# EAGLE design simple_controller (EAGLE 9.3.1)

## Sheet 1 of 3
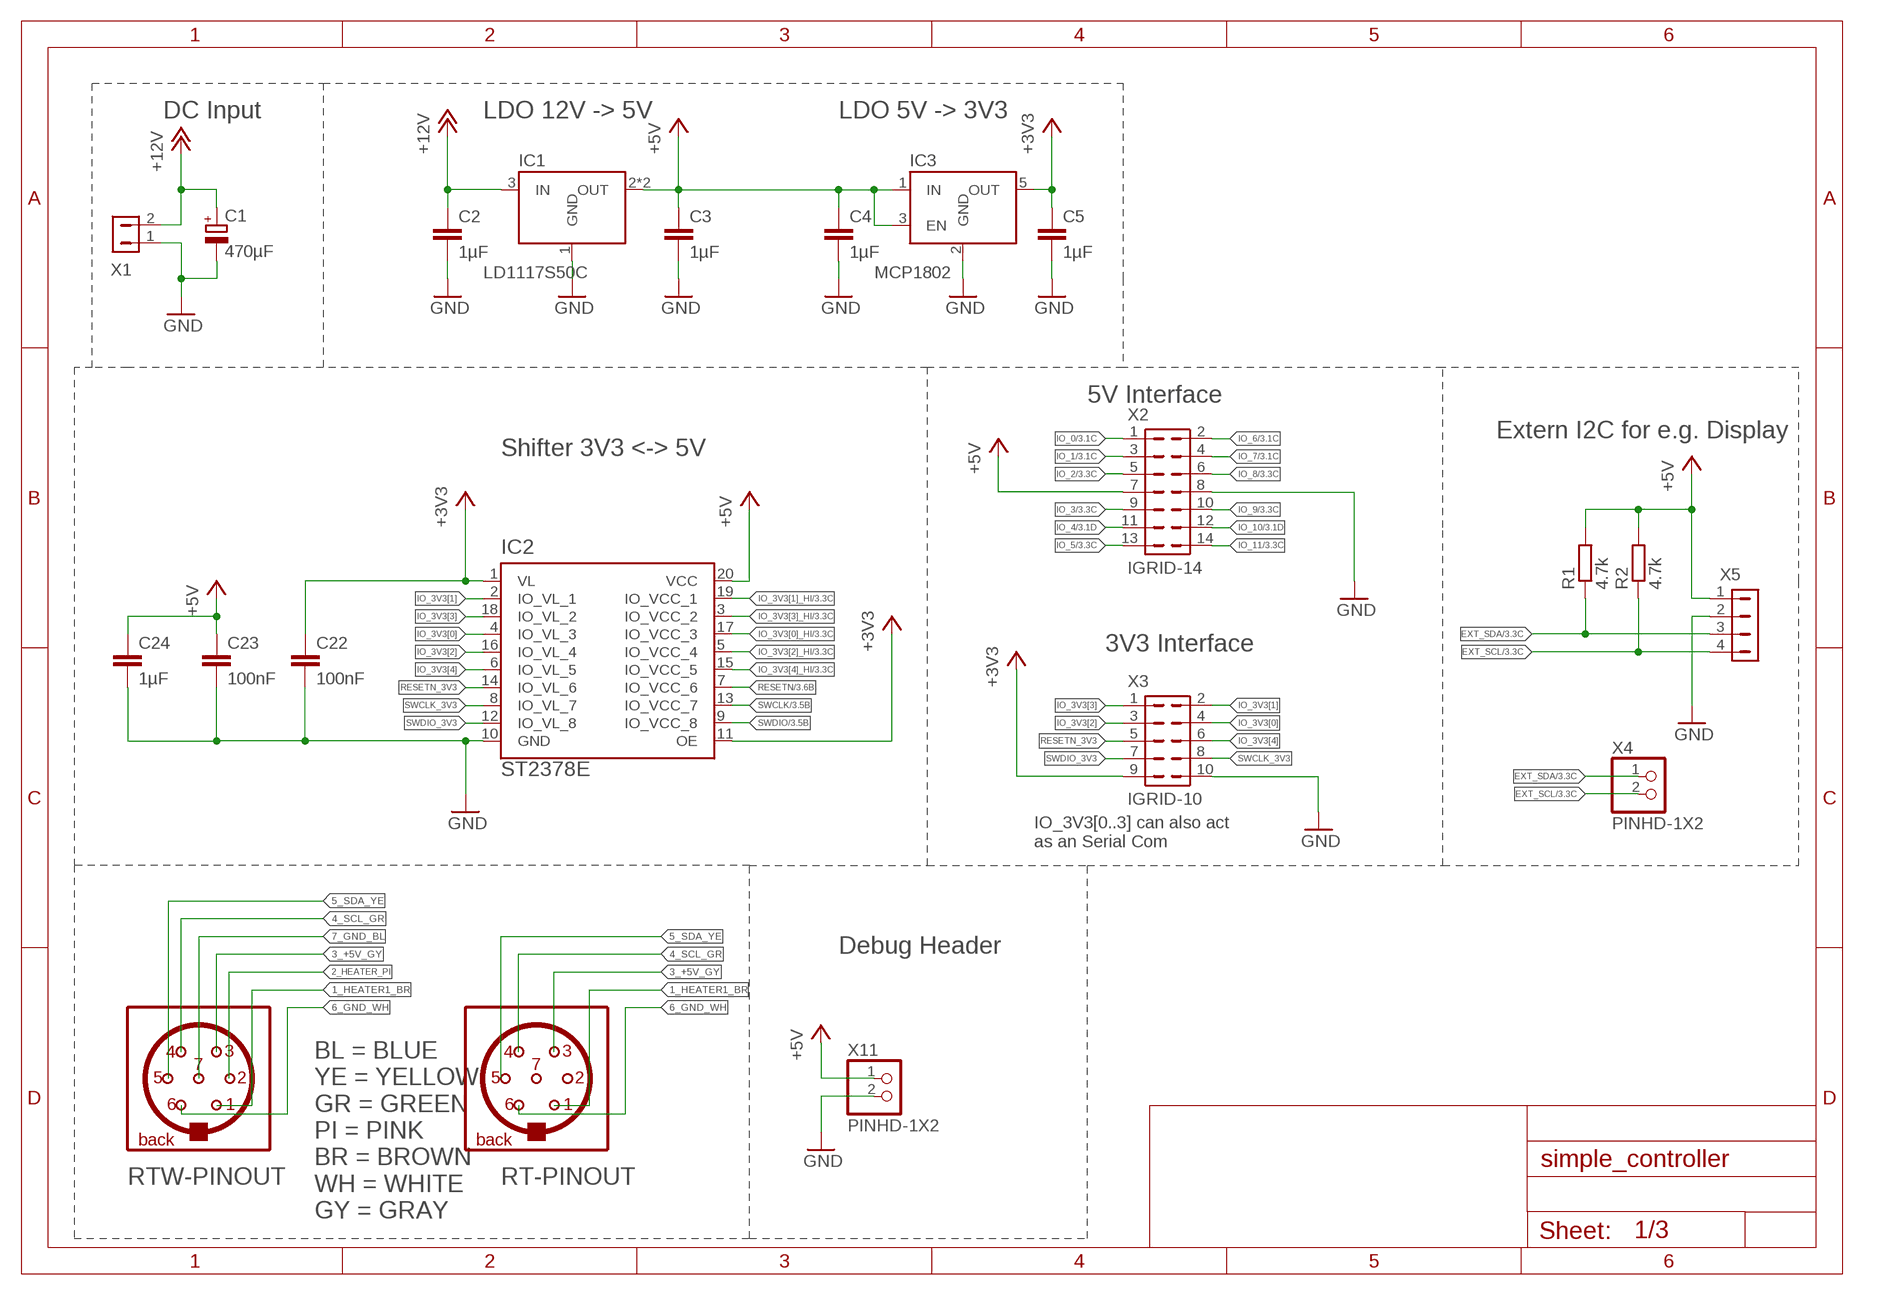
[diagram p0: schematic, sheet 1]

### Parts
C1  470µF  C-EEEFK  [C_EEEFK-10X10]
C2  1µF  C-EUC0805  [C0805]
C3  1µF  C-EUC0805  [C0805]
C4  1µF  C-EUC0805  [C0805]
C5  1µF  C-EUC0805  [C0805]
C22  100nF  C-EUC0402  [C0402]
C23  100nF  C-EUC0402  [C0402]
C24  1µF  C-EUC0402  [C0402]
CON1  BINDER-IP40  (no package)
CON2  BINDER-IP40  (no package)
IC1  LD1117S50C  [SOT223]
IC2  ST2378E  [TSSOP20]
IC3  MCP1802  [SOT23-5L]
R1  4.7k  R-EU_R0603  [R0603]
R2  4.7k  R-EU_R0603  [R0603]
X1  NANOFIT-2  [NANOFIT-2-90]
X2  IGRID-14  [I-GRID-14]
X3  IGRID-10  [I-GRID-10]
X4  PINHD-1X2  [1X02]
X5  MICRO-LATCH-4  [MICRO-LATCH-4]
X11  PINHD-1X2  [1X02]

### Nets
1_HEATER1_BR: CON1.P$4 CON2.P$4
2_HEATER_PI: CON1.P$2
3_+5V_GY: CON1.P$3 CON2.P$3
4_SCL_GR: CON1.P$6 CON2.P$6
5_SDA_YE: CON1.P$7
6_GND_WH: CON1.P$5 CON2.P$5
7_GND_BL: CON1.P$1
+3V3: C5.1 C22.1 IC2.1(VL) IC2.11(OE) IC3.5(OUT) X3.9
+5V: C3.1 C4.1 C23.1 C24.1 IC1.2(OUT) IC1.4(OUT) IC2.20(VCC) IC3.1(IN) IC3.3(EN) R1.2 R2.2 X2.7 X5.1 X11.1 ; also sheet 2,3
+12V: C1.+ C2.1 IC1.3(IN) X1.2 ; also sheet 2
EXT_SCL: R2.1 X4.2 X5.4 ; also sheet 3
EXT_SDA: R1.1 X4.1 X5.3 ; also sheet 3
GND: C1.- C2.2 C3.2 C4.2 C5.2 C22.2 C23.2 C24.2 IC1.1(GND) IC2.10(GND) IC3.2(GND) X1.1 X2.8 X3.10 X5.2 X11.2 ; also sheet 2,3
IO_0: X2.1 ; also sheet 3
IO_1: X2.3 ; also sheet 3
IO_2: X2.5 ; also sheet 3
IO_3: X2.9 ; also sheet 3
IO_3V3[0]: IC2.4(IO_VL_3) X3.4
IO_3V3[0]_HI: IC2.17(IO_VCC_3) ; also sheet 3
IO_3V3[1]: IC2.2(IO_VL_1) X3.2
IO_3V3[1]_HI: IC2.19(IO_VCC_1) ; also sheet 3
IO_3V3[2]: IC2.16(IO_VL_4) X3.3
IO_3V3[2]_HI: IC2.5(IO_VCC_4) ; also sheet 3
IO_3V3[3]: IC2.18(IO_VL_2) X3.1
IO_3V3[3]_HI: IC2.3(IO_VCC_2) ; also sheet 3
IO_3V3[4]: IC2.6(IO_VL_5) X3.6
IO_3V3[4]_HI: IC2.15(IO_VCC_5) ; also sheet 3
IO_4: X2.11 ; also sheet 3
IO_5: X2.13 ; also sheet 3
IO_6: X2.2 ; also sheet 3
IO_7: X2.4 ; also sheet 3
IO_8: X2.6 ; also sheet 3
IO_9: X2.10 ; also sheet 3
IO_10: X2.12 ; also sheet 3
IO_11: X2.14 ; also sheet 3
RESETN: IC2.7(IO_VCC_6) ; also sheet 3
RESETN_3V3: IC2.14(IO_VL_6) X3.5
SWCLK: IC2.13(IO_VCC_7) ; also sheet 3
SWCLK_3V3: IC2.8(IO_VL_7) X3.8
SWDIO: IC2.9(IO_VCC_8) ; also sheet 3
SWDIO_3V3: IC2.12(IO_VL_8) X3.7
Unconnected: CON2.P$1 CON2.P$2 CON2.P$7

### Notes on the sheet
- DC Input | LDO 12V -> 5V | LDO 5V -> 3V3
- 5V Interface
- Extern I2C for e.g. Display
- Shifter 3V3 <-> 5V
- 3V3 Interface
- IO_3V3[0..3] can also act 
  as an Serial Com
- Debug Header
- BL = BLUE
  YE = YELLOW
  GR = GREEN
  PI = PINK
  BR = BROWN
  WH = WHITE
  GY = GRAY
- RTW-PINOUT | RT-PINOUT

## Sheet 2 of 3
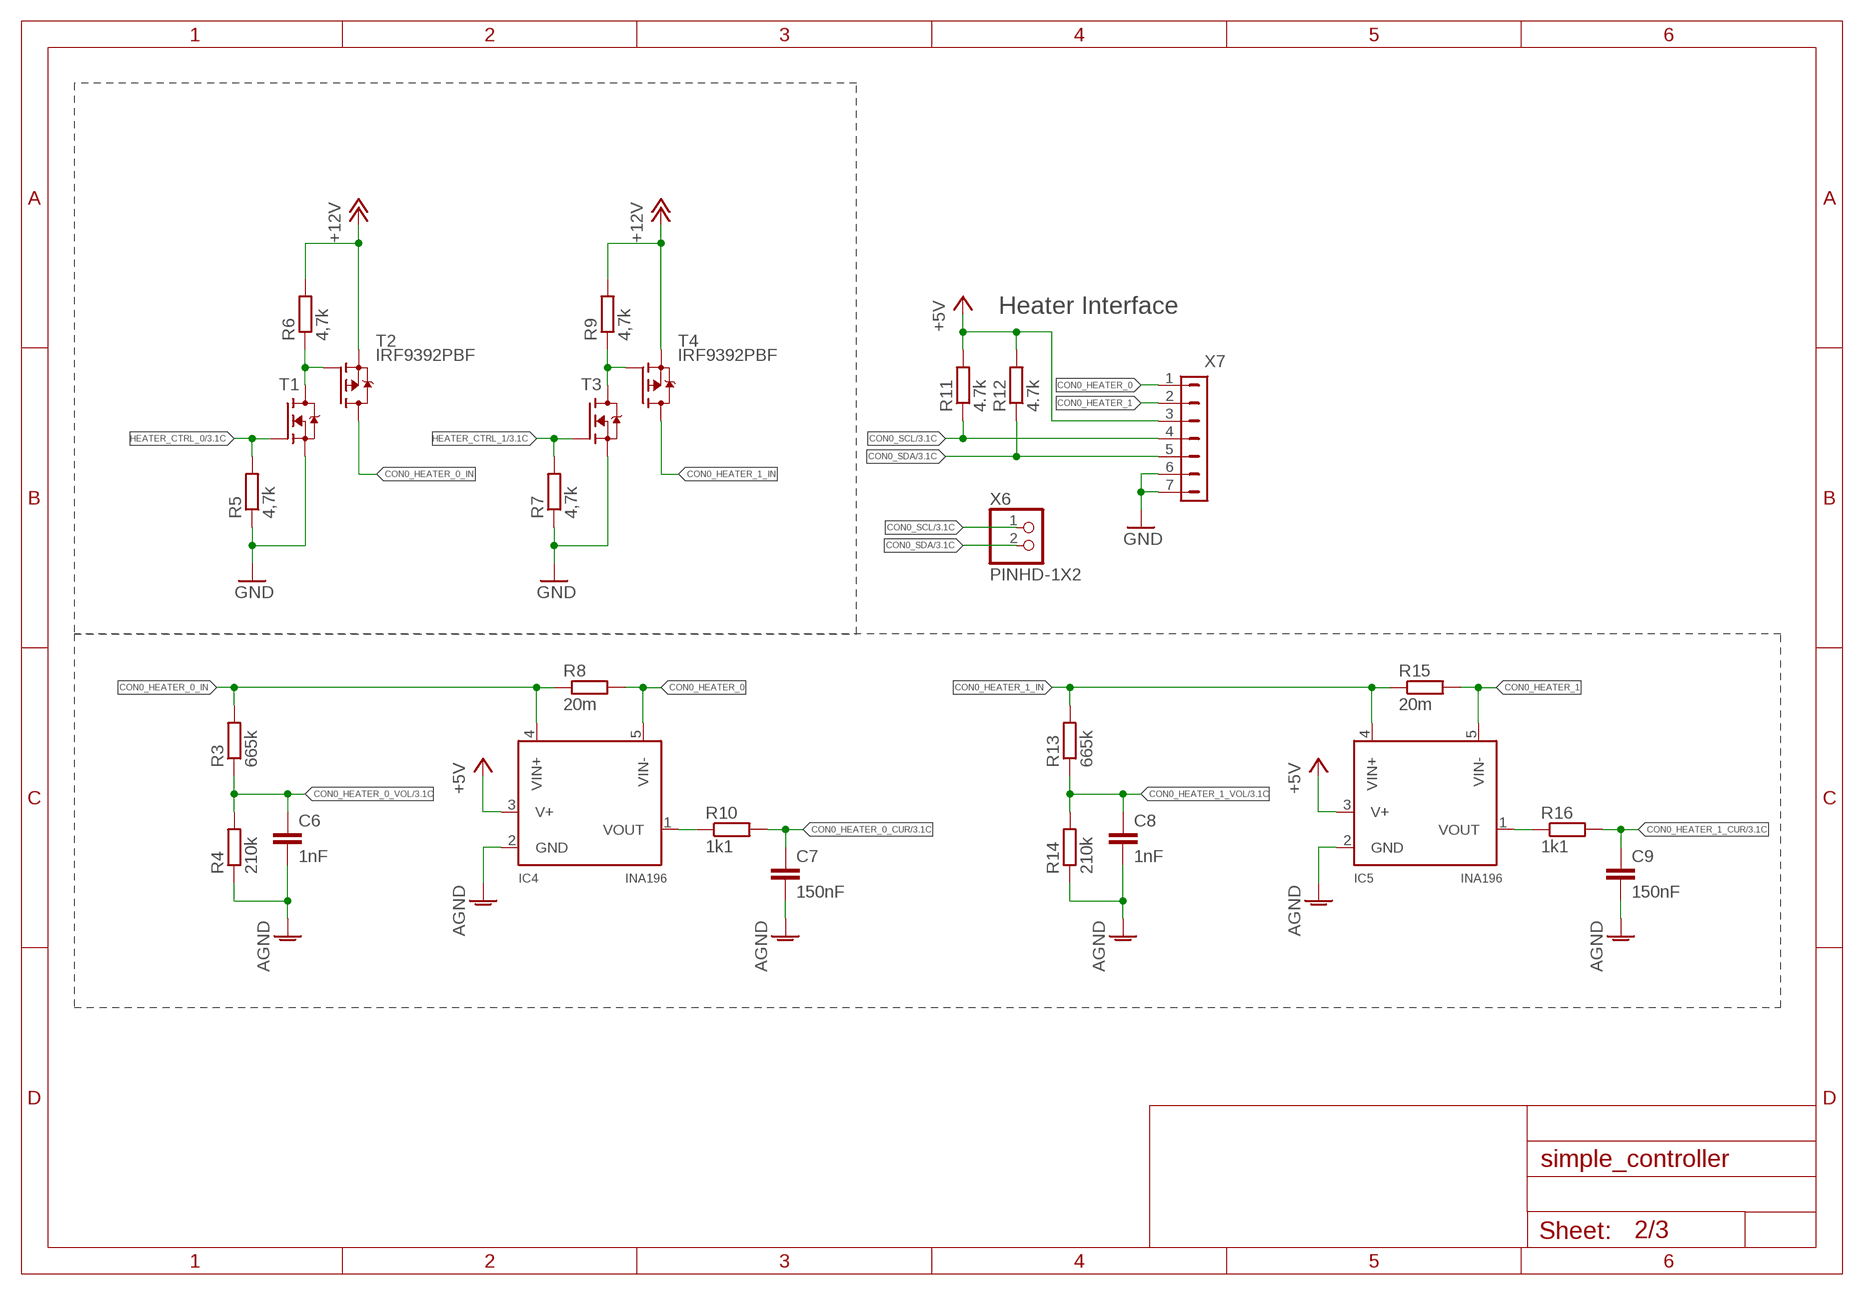
[diagram p1: schematic, sheet 2]

### Parts
C6  1nF  C-EUC0603  [C0603]
C7  150nF  C-EUC0603  [C0603]
C8  1nF  C-EUC0603  [C0603]
C9  150nF  C-EUC0603  [C0603]
IC4  INA196  [SOT23-5L]
IC5  INA196  [SOT23-5L]
R3  665k  R-EU_R0603  [R0603]
R4  210k  R-EU_R0603  [R0603]
R5  4,7k  R-EU_R0805  [R0805]
R6  4,7k  R-EU_R0805  [R0805]
R7  4,7k  R-EU_R0805  [R0805]
R8  20m  R-EU_R1206  [R1206]
R9  4,7k  R-EU_R0805  [R0805]
R10  1k1  R-EU_R0603  [R0603]
R11  4.7k  R-EU_R0603  [R0603]
R12  4.7k  R-EU_R0603  [R0603]
R13  665k  R-EU_R0603  [R0603]
R14  210k  R-EU_R0603  [R0603]
R15  20m  R-EU_R1206  [R1206]
R16  1k1  R-EU_R0603  [R0603]
T1  NVR4003NT3G  [SOT23]
T2  IRF9392PBF  [SO8]
T3  NVR4003NT3G  [SOT23]
T4  IRF9392PBF  [SO8]
X6  PINHD-1X2  [1X02]
X7  NANOFIT-7  [NANOFIT-7]

### Nets
+5V: IC4.3(V+) IC5.3(V+) R11.2 R12.2 X7.3 ; also sheet 1,3
+12V: R6.2 R9.2 T2.1(S) T2.2(S) T2.3(S) T4.1(S) T4.2(S) T4.3(S) ; also sheet 1
AGND: C6.2 C7.2 C8.2 C9.2 IC4.2(GND) IC5.2(GND) R4.1 R14.1 ; also sheet 3
CON0_HEATER_0: IC4.5(VIN-) R8.2 X7.1
CON0_HEATER_0_CUR: C7.1 R10.2 ; also sheet 3
CON0_HEATER_0_IN: IC4.4(VIN+) R3.2 R8.1 T2.5(D) T2.6(D) T2.7(D) T2.8(D)
CON0_HEATER_0_VOL: C6.1 R3.1 R4.2 ; also sheet 3
CON0_HEATER_1: IC5.5(VIN-) R15.2 X7.2
CON0_HEATER_1_CUR: C9.1 R16.2 ; also sheet 3
CON0_HEATER_1_IN: IC5.4(VIN+) R13.2 R15.1 T4.5(D) T4.6(D) T4.7(D) T4.8(D)
CON0_HEATER_1_VOL: C8.1 R13.1 R14.2 ; also sheet 3
CON0_SCL: R11.1 X6.1 X7.4 ; also sheet 3
CON0_SDA: R12.1 X6.2 X7.5 ; also sheet 3
GND: R5.1 R7.1 T1.2(S) T3.2(S) X7.6 X7.7 ; also sheet 1,3
HEATER0_AD_OUT0: IC4.1(VOUT) R10.1
HEATER0_AD_OUT1: IC5.1(VOUT) R16.1
HEATER0_G0: R6.1 T1.3(D) T2.4(G)
HEATER0_G1: R9.1 T3.3(D) T4.4(G)
HEATER_CTRL_0: R5.2 T1.1(G) ; also sheet 3
HEATER_CTRL_1: R7.2 T3.1(G) ; also sheet 3

### Notes on the sheet
- Heater Interface

## Sheet 3 of 3
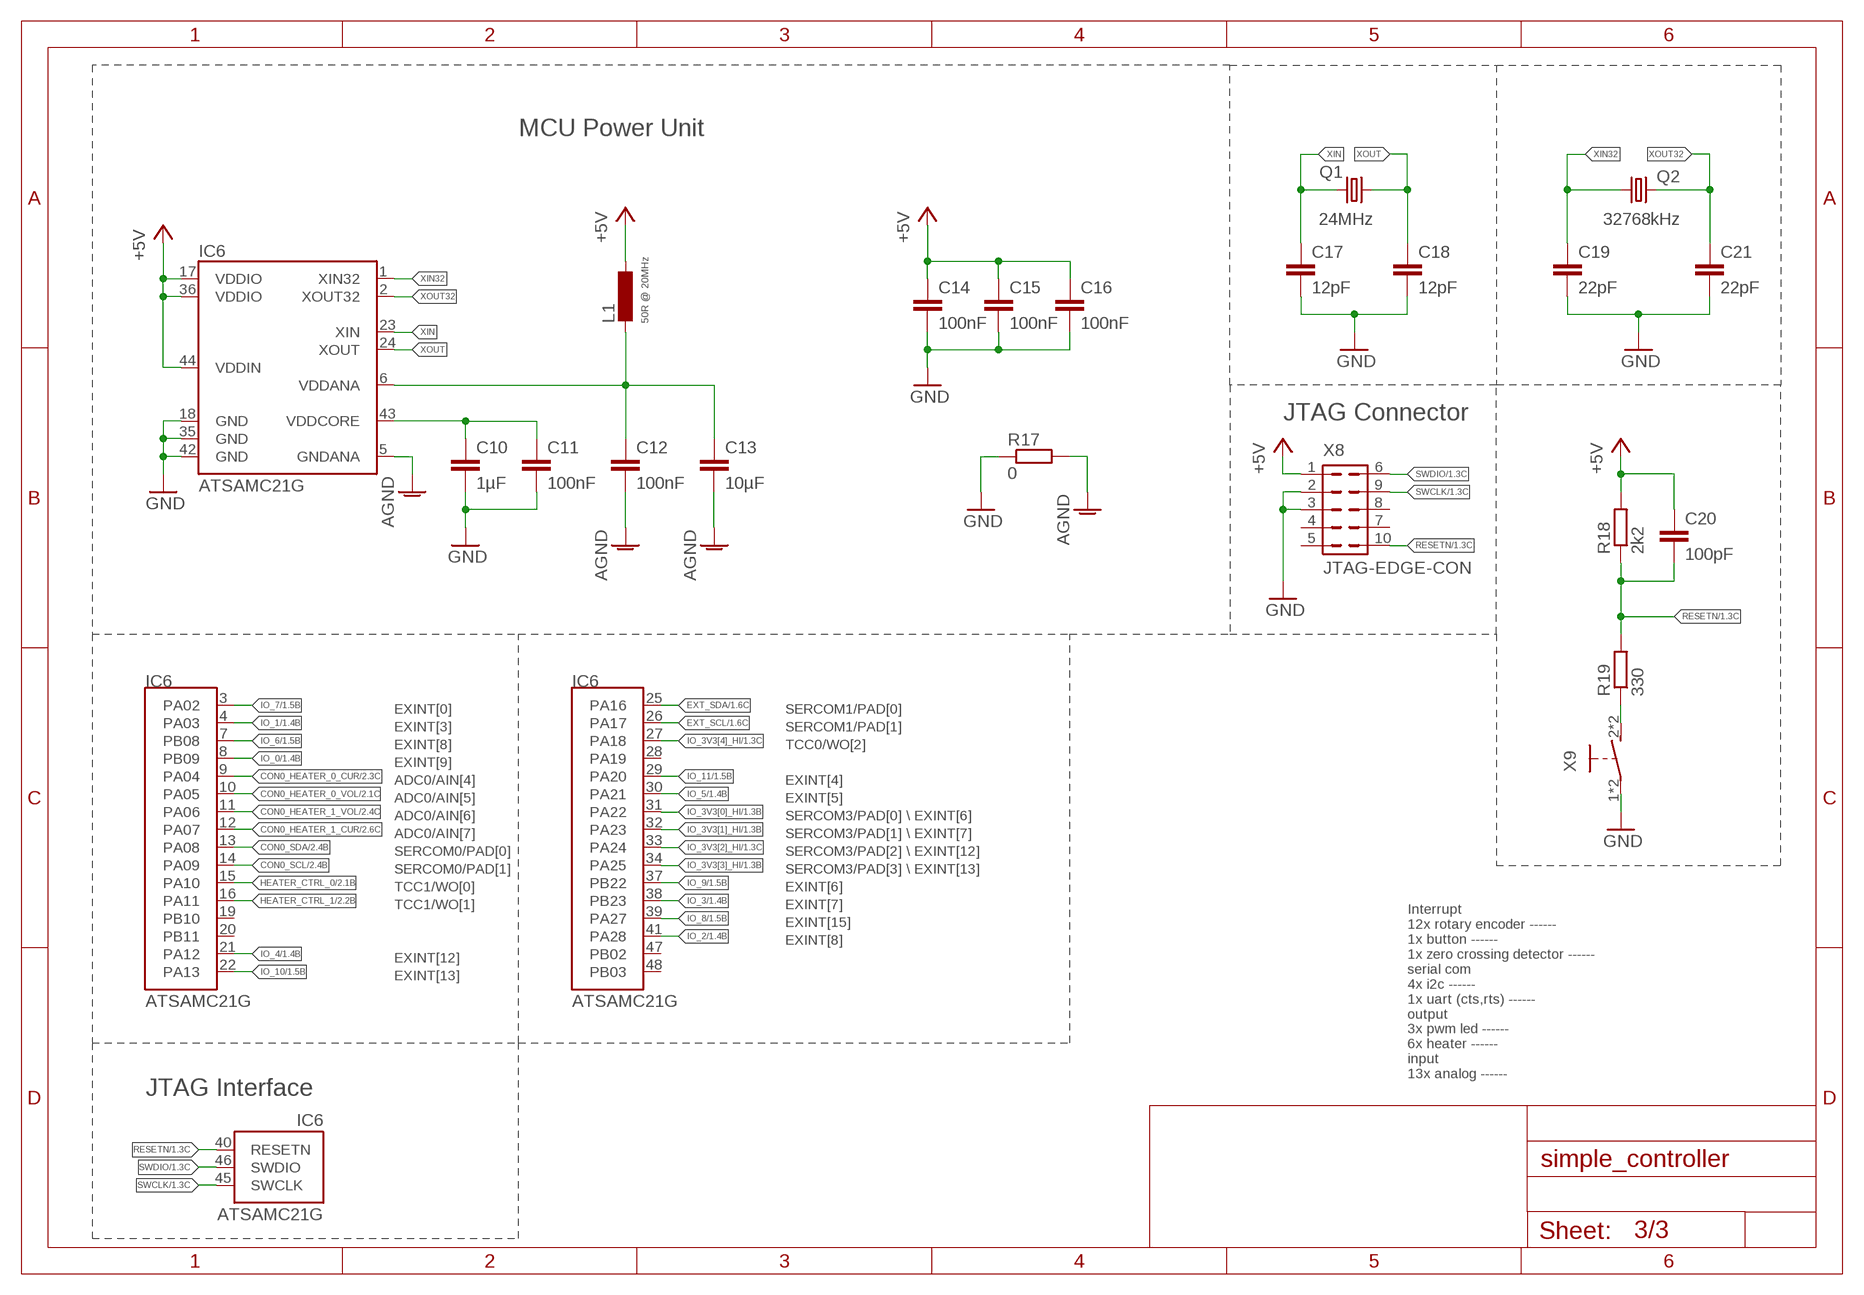
[diagram p2: schematic, sheet 3]

### Parts
C10  1µF  C-EUC0402  [C0402]
C11  100nF  C-EUC0402  [C0402]
C12  100nF  C-EUC0402  [C0402]
C13  10µF  C-EUC0805  [C0805]
C14  100nF  C-EUC0402  [C0402]
C15  100nF  C-EUC0402  [C0402]
C16  100nF  C-EUC0402  [C0402]
C17  12pF  C-EUC0402  [C0402]
C18  12pF  C-EUC0402  [C0402]
C19  22pF  C-EUC0402  [C0402]
C20  100pF  C-EUC0603  [C0603]
C21  22pF  C-EUC0402  [C0402]
IC6  ATSAMC21G  [TQFP48]
L1  50R @ 20MHz  L-0603  [L0603]
Q1  24MHz  XRCHA_F_A  [HCR2520]
Q2  32768kHz  9HT11  [2X1.2]
R17  0  R-EU_R1210  [R1210]
R18  2k2  R-EU_R0603  [R0603]
R19  330  R-EU_R0603  [R0603]
X8  JTAG-EDGE-CON  [DEBUG-CON]
X9  B3S-1000  [B3S]

### Nets
+5V: C14.1 C15.1 C16.1 C20.1 IC6.17(VDDIO) IC6.36(VDDIO) IC6.44(VDDIN) L1.1 R18.2 X8.1 ; also sheet 1,2
AGND: C12.2 C13.2 IC6.5(GNDANA) R17.2 ; also sheet 2
CON0_HEATER_0_CUR: IC6.9(PA04) ; also sheet 2
CON0_HEATER_0_VOL: IC6.10(PA05) ; also sheet 2
CON0_HEATER_1_CUR: IC6.12(PA07) ; also sheet 2
CON0_HEATER_1_VOL: IC6.11(PA06) ; also sheet 2
CON0_SCL: IC6.14(PA09) ; also sheet 2
CON0_SDA: IC6.13(PA08) ; also sheet 2
EXT_SCL: IC6.26(PA17) ; also sheet 1
EXT_SDA: IC6.25(PA16) ; also sheet 1
GND: C10.2 C11.2 C14.2 C15.2 C16.2 C17.2 C18.2 C19.2 C21.2 IC6.18(GND) IC6.35(GND) IC6.42(GND) R17.1 X8.2 X8.3 X9.1(P) X9.3(P) ; also sheet 1,2
HEATER_CTRL_0: IC6.15(PA10) ; also sheet 2
HEATER_CTRL_1: IC6.16(PA11) ; also sheet 2
IO_0: IC6.8(PB09) ; also sheet 1
IO_1: IC6.4(PA03) ; also sheet 1
IO_2: IC6.41(PA28) ; also sheet 1
IO_3: IC6.38(PB23) ; also sheet 1
IO_3V3[0]_HI: IC6.31(PA22) ; also sheet 1
IO_3V3[1]_HI: IC6.32(PA23) ; also sheet 1
IO_3V3[2]_HI: IC6.33(PA24) ; also sheet 1
IO_3V3[3]_HI: IC6.34(PA25) ; also sheet 1
IO_3V3[4]_HI: IC6.27(PA18) ; also sheet 1
IO_4: IC6.21(PA12) ; also sheet 1
IO_5: IC6.30(PA21) ; also sheet 1
IO_6: IC6.7(PB08) ; also sheet 1
IO_7: IC6.3(PA02) ; also sheet 1
IO_8: IC6.39(PA27) ; also sheet 1
IO_9: IC6.37(PB22) ; also sheet 1
IO_10: IC6.22(PA13) ; also sheet 1
IO_11: IC6.29(PA20) ; also sheet 1
RESET_SW_IN: R19.1 X9.2(S) X9.4(S)
RESETN: C20.2 IC6.40(RESETN) R18.1 R19.2 X8.10 ; also sheet 1
SWCLK: IC6.45(SWCLK) X8.9 ; also sheet 1
SWDIO: IC6.46(SWDIO) X8.6 ; also sheet 1
VDDANA: C12.1 C13.1 IC6.6(VDDANA) L1.2
VDDCORE: C10.1 C11.1 IC6.43(VDDCORE)
XIN: C17.1 IC6.23(XIN) Q1.1
XIN32: C19.1 IC6.1(XIN32) Q2.1
XOUT: C18.1 IC6.24(XOUT) Q1.2
XOUT32: C21.1 IC6.2(XOUT32) Q2.2
Unconnected: IC6.19(PB10) IC6.20(PB11) IC6.28(PA19) IC6.47(PB02) IC6.48(PB03) X8.4 X8.5 X8.7 X8.8

### Notes on the sheet
- MCU Power Unit
- JTAG Connector
- EXINT[0] | SERCOM1/PAD[0]
- EXINT[3] | SERCOM1/PAD[1]
- EXINT[8] | TCC0/WO[2]
- EXINT[9]
- ADC0/AIN[4] | EXINT[4]
- ADC0/AIN[5] | EXINT[5]
- ADC0/AIN[6] | SERCOM3/PAD[0] \\ EXINT[6]
- ADC0/AIN[7] | SERCOM3/PAD[1] \\ EXINT[7]
- SERCOM0/PAD[0] | SERCOM3/PAD[2] \\ EXINT[12]
- SERCOM0/PAD[1] | SERCOM3/PAD[3] \\ EXINT[13]
- TCC1/WO[0] | EXINT[6]
- TCC1/WO[1] | EXINT[7]
- EXINT[15]
- EXINT[8]
- EXINT[12]
- EXINT[13]
- Interrupt
  12x rotary encoder ------
  1x button ------
  1x zero crossing detector ------
  serial com
  4x i2c ------
  1x uart (cts,rts) ------
  output
  3x pwm led ------
  6x heater ------
  input
  13x analog ------
- JTAG Interface

## Library data of the parts
C1 = solderpi:C-EEEFK; OC_MOUSER: 667-EEE-FK1E471P
C2-C5 C13 = rcl:C-EU: CAPACITOR, European symbol; OC_MOUSER: 81-GRM21BR61E106MA3L; SPICEPREFIX: C
C6 C8 = rcl:C-EU: CAPACITOR, European symbol; OC_MOUSER: 710-885012206059; SPICEPREFIX: C
C7 C9 = rcl:C-EU: CAPACITOR, European symbol; OC_MOUSER: 810-C1608X5R1E154K; SPICEPREFIX: C
C10 C24 = rcl:C-EU: CAPACITOR, European symbol; OC_MOUSER: 81-GRM155R61C105MA2D; SPICEPREFIX: C
C11 C12 C14-C16 C22 C23 = rcl:C-EU: CAPACITOR, European symbol; OC_MOUSER: 710-885012105016; SPICEPREFIX: C
C17 C18 = rcl:C-EU: CAPACITOR, European symbol; OC_MOUSER: 77-VJ0402A120JXAPBC; SPICEPREFIX: C
C19 C21 = rcl:C-EU: CAPACITOR, European symbol; OC_MOUSER: 710-885012005027; SPICEPREFIX: C
C20 = rcl:C-EU: CAPACITOR, European symbol; OC_MOUSER: 710-885012006023; SPICEPREFIX: C
CON1 CON2 = solderpi:BINDER-IP40
IC1 = solderpi:LD1117S50C; OC_MOUSER: 511-LD1117S50C-TR
IC2 = solderpi:ST2378E; OC_MOUSER: 511-ST2378ET
IC3 = solderpi:MCP1802
IC4 IC5 = solderpi:INA196; OC_MOUSER: 595-INA196AIDBVT
IC6 = solderpi:ATSAMC21G; OC_MOUSER: 556-ATSAMC21G18A-AUT
L1 = solderpi:L-0603; OC_MOUSER: 81-BLM18AG151SZ1D
Q1 = solderpi:XRCHA_F_A; OC_MOUSER: 81-XRCHA24M000F0A1R0
Q2 = solderpi:9HT11; OC_MOUSER: 717-9HT11-32.7KDZC-T
R1 R2 R11 R12 = rcl:R-EU_: RESISTOR, European symbol; OC_MOUSER: 603-RC0603FR-0710KL; SPICEPREFIX: R
R3 R13 = rcl:R-EU_: RESISTOR, European symbol; OC_MOUSER: 71-CRCW0603-665K-E3; SPICEPREFIX: R
R4 R14 = rcl:R-EU_: RESISTOR, European symbol; OC_MOUSER: 603-RC0603FR-10220KL; SPICEPREFIX: R
R5-R7 R9 = rcl:R-EU_: RESISTOR, European symbol; OC_MOUSER: 652-CR0805-FX4701GLF; SPICEPREFIX: R
R8 R15 = rcl:R-EU_: RESISTOR, European symbol; OC_MOUSER: 791-WW12DR020FTL; SPICEPREFIX: R
R10 R16 = rcl:R-EU_: RESISTOR, European symbol; OC_MOUSER: 603-AC0603FR-071K1L; SPICEPREFIX: R
R17 = rcl:R-EU_: RESISTOR, European symbol; OC_MOUSER: 603-AC1210JR-070RL; SPICEPREFIX: R
R18 = rcl:R-EU_: RESISTOR, European symbol; OC_MOUSER: 603-RC0603FR-072K2L; SPICEPREFIX: R
R19 = rcl:R-EU_: RESISTOR, European symbol; OC_MOUSER: 594-MCT06030C3300FP5; SPICEPREFIX: R
T1 T3 = solderpi:NVR4003NT3G; OC_MOUSER: 863-NVR4003NT3G
T2 T4 = solderpi:IRF9392PBF; OC_MOUSER: 942-IRF9392TRPBF
X1 = solderpi:NANOFIT-2; OC_MOUSER: 538-105313-2102; 538-105325-1002; 538-105307-1202
X2 = solderpi:IGRID-14; OC_MOUSER: 538-501646-1400; 538-501645-1420
X3 = solderpi:IGRID-10; OC_MOUSER: 538-501645-1020, 538-501646-1000
X4 X6 X11 = solderpi:PINHD-1X2: PIN HEADER; OC_MOUSER: 855-M20-9990246
X5 = solderpi:MICRO-LATCH-4; OC_MOUSER: 538-53253-0470, 538-51065-0400
X7 = solderpi:NANOFIT-7; OC_MOUSER: 538-105313-1107, 538-105307-1207
X8 = solderpi:JTAG-EDGE-CON; OC_MOUSER: 649-1001878311110TLF
X9 = solderpi:B3S-1000; OC_FARNELL: 177807; OC_MOUSER: 653-B3S-1000

## Net classes
0 µC: width 0.2 mm, drill 0.3 mm, clearance 0.2 mm
1 +12V: width 0.4 mm, drill 0.35 mm, clearance 0.3 mm

## Board
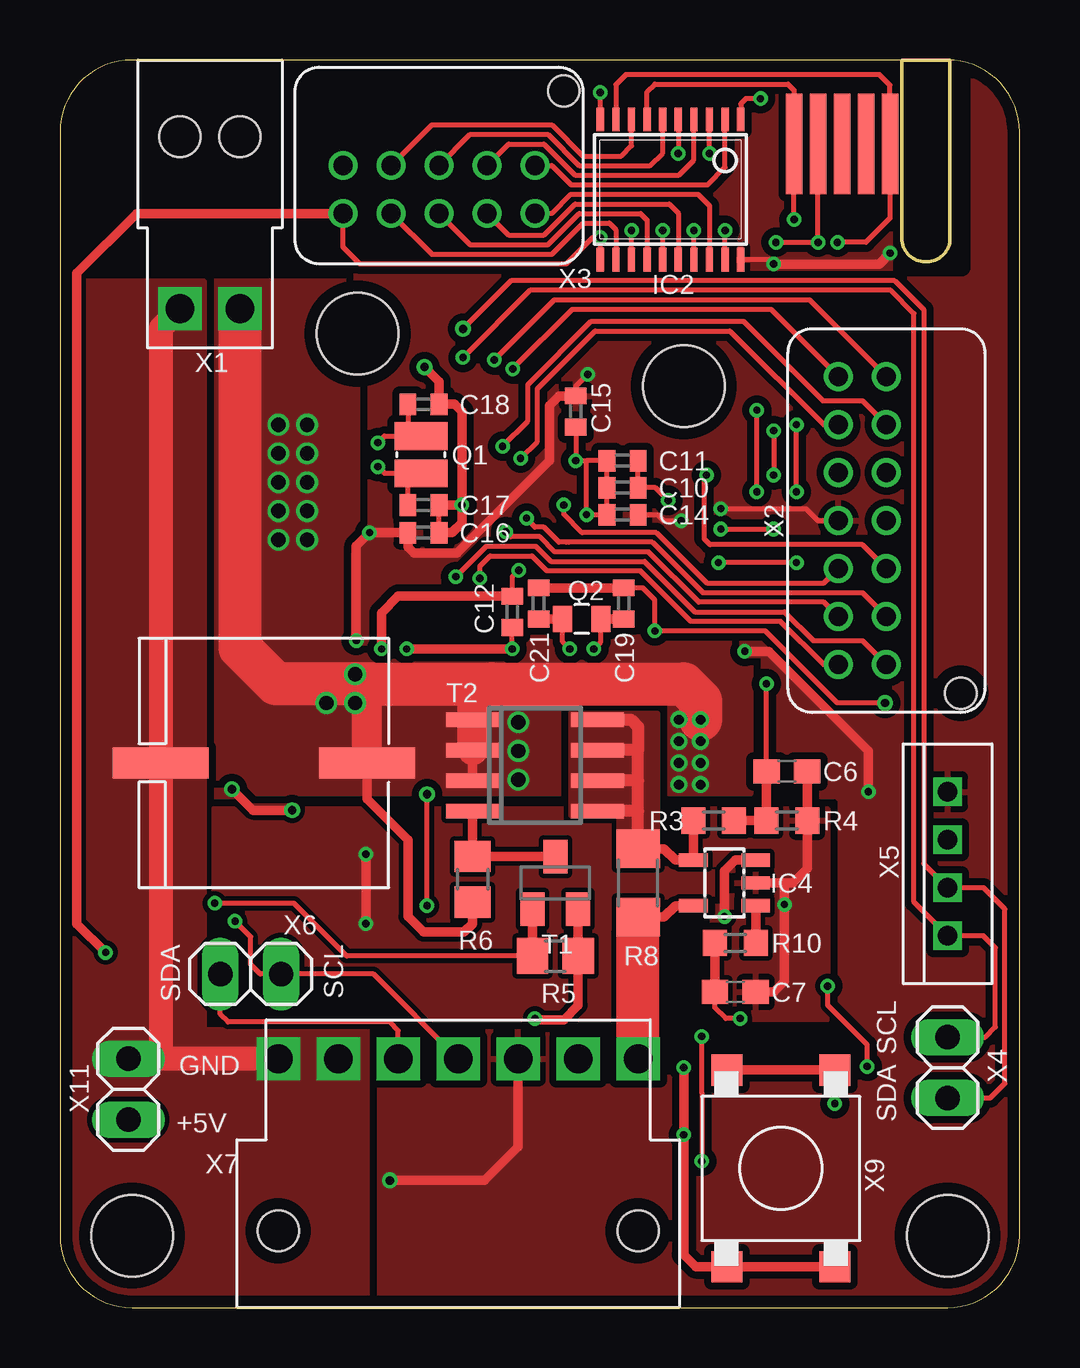
[diagram p3: board, top side]
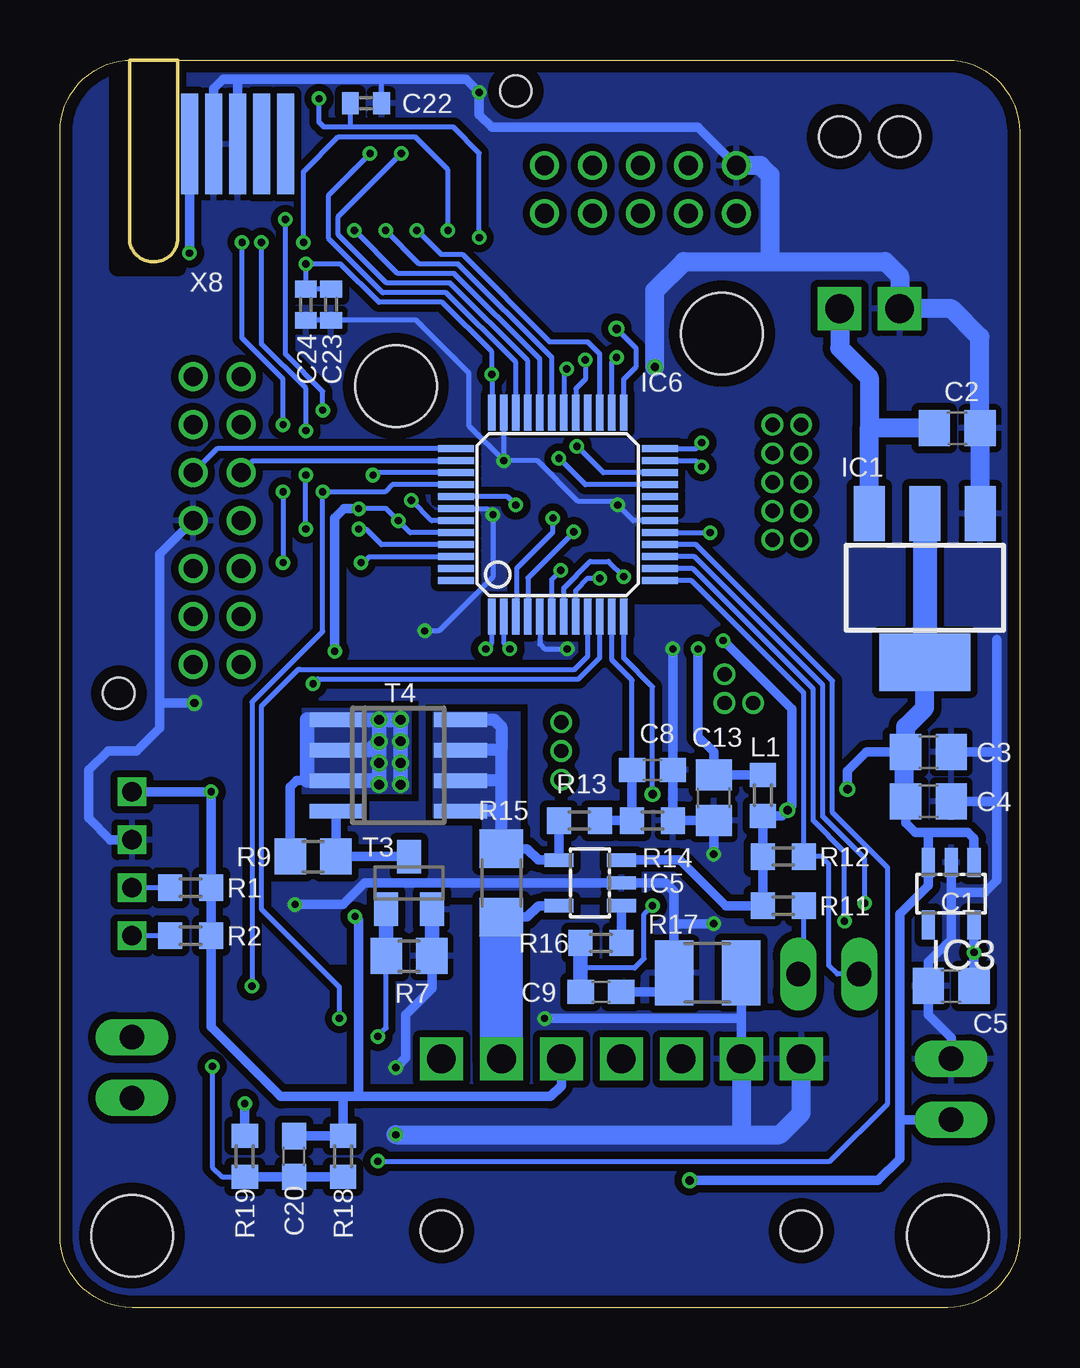
[diagram p4: board, bottom side, seen from below]

Size 40 x 52 mm. Coordinates in mm from the lower left corner, seen from the top.
Outline: 3,0 37,0 arc90 40,3 40,49 arc90 37,52 3,52 arc90 0,49 0,3 arc90 3,0
Copper layers (1*16): Top 0.035mm / dielectric 1.6mm / Bottom 0.035mm
Design rules "Elecrow_2-layer_PCB_eagle_rule *": minimum track width 6mil, minimum drill 0.3mm, track to track 0.2mm, track to pad 0.2mm, pad to pad 6mil, via to via 8mil, smd to smd 0mil, copper to edge 20mil, drill to drill 10mil, minimum pad ring 6mil, minimum via ring 6mil, stop-mask expansion 0mil, vias tented up to drill 100mil, thermal gap 10mil
Holes 3.4 mm at 26,38.4 12.4,40.6 37,3 3,3

### Footprints (pad centres in the part's own frame; a part is rotated, then mirrored left to right if it is on the bottom)
C_EEEFK-10X10 = smd 4 x 1.3: + -4.3,0; - 4.3,0
C0805 = smd 1.3 x 1.5: 1 -0.95,0; 2 0.95,0
C0603 = smd 1.1 x 1: 1 -0.85,0; 2 0.85,0
C0402 = smd 0.7 x 0.9: 1 -0.65,0; 2 0.65,0
SOT223 = smd 1.3 x 2.3: 1 -2.311,-3.099; 2 0,-3.099; 3 2.311,-3.099 | smd 3.8 x 2.4: 4 0,3.099
TSSOP20 = smd 0.305 x 0.991: 1 -2.925,-2.918; 2 -2.275,-2.918; 3 -1.625,-2.918; 4 -0.975,-2.918; 5 -0.325,-2.918; 6 0.325,-2.918; 7 0.975,-2.918; 8 1.625,-2.918; 9 2.275,-2.918; 10 2.925,-2.918; 11 2.925,2.918; 12 2.275,2.918; 13 1.625,2.918; 14 0.975,2.918; 15 0.325,2.918; 16 -0.325,2.918; 17 -0.975,2.918; 18 -1.625,2.918; 19 -2.275,2.918; 20 -2.925,2.918
SOT23-5L = smd 0.55 x 1.2: 1 -0.95,-1.3; 2 0,-1.3; 3 0.95,-1.3; 4 0.95,1.3; 5 -0.95,1.3
TQFP48 = smd 0.3 x 1.5: 1 -2.75,-4.25; 2 -2.25,-4.25; 3 -1.75,-4.25; 4 -1.25,-4.25; 5 -0.75,-4.25; 6 -0.25,-4.25; 7 0.25,-4.25; 8 0.75,-4.25; 9 1.25,-4.25; 10 1.75,-4.25; 11 2.25,-4.25; 12 2.75,-4.25; 25 2.75,4.25; 26 2.25,4.25; 27 1.75,4.25; 28 1.25,4.25; 29 0.75,4.25; 30 0.25,4.25; 31 -0.25,4.25; 32 -0.75,4.25; 33 -1.25,4.25; 34 -1.75,4.25; 35 -2.25,4.25; 36 -2.75,4.25 | smd 1.5 x 0.3: 13 4.25,-2.75; 14 4.25,-2.25; 15 4.25,-1.75; 16 4.25,-1.25; 17 4.25,-0.75; 18 4.25,-0.25; 19 4.25,0.25; 20 4.25,0.75; 21 4.25,1.25; 22 4.25,1.75; 23 4.25,2.25; 24 4.25,2.75; 37 -4.25,2.75; 38 -4.25,2.25; 39 -4.25,1.75; 40 -4.25,1.25; 41 -4.25,0.75; 42 -4.25,0.25; 43 -4.25,-0.25; 44 -4.25,-0.75; 45 -4.25,-1.25; 46 -4.25,-1.75; 47 -4.25,-2.25; 48 -4.25,-2.75
L0603 = smd 1 x 1.1: 1 -0.85,0; 2 0.85,0
HCR2520 = smd 1.15 x 2.2: 1 -0.775,0; 2 0.775,0
2X1.2 = smd 0.8 x 1.1: 1 -0.8,0; 2 0.8,0
R0603 = smd 1 x 1.1: 1 -0.85,0; 2 0.85,0
R0805 = smd 1.3 x 1.5: 1 -0.95,0; 2 0.95,0
R1206 = smd 1.6 x 1.803: 1 -1.422,0; 2 1.422,0
R1210 = smd 1.6 x 2.7: 1 -1.4,0; 2 1.4,0
SOT23 = smd 1 x 1.4: 1 -0.95,-1.1; 2 0.95,-1.1; 3 0,1.1
SO8 = smd 0.6 x 2.2: 1 -1.905,-2.6; 2 -0.635,-2.6; 3 0.635,-2.6; 4 1.905,-2.6; 5 1.905,2.6; 6 0.635,2.6; 7 -0.635,2.6; 8 -1.905,2.6
NANOFIT-2-90 = drill 1.2 square: 1 1.25,10.37; 2 -1.25,10.37 | hole 1.7: -1.25,3.2; 1.25,3.2
I-GRID-14 = drill 0.8: 1 -6,2; 2 -6,0; 3 -4,2; 4 -4,0; 5 -2,2; 6 -2,0; 7 0,2; 8 0,0; 9 2,2; 10 2,0; 11 4,2; 12 4,0; 13 6,2; 14 6,0 | hole 1.3: -7.2,-3.1
I-GRID-10 = drill 0.8: 1 -4,2; 2 -4,0; 3 -2,2; 4 -2,0; 5 0,2; 6 0,0; 7 2,2; 8 2,0; 9 4,2; 10 4,0 | hole 1.3: -5.2,-3.1
1X02 = drill 1.016 long: 1 -1.27,0; 2 1.27,0
MICRO-LATCH-4 = drill 0.8 square: 1 -3,0; 2 -1,0; 3 1,0; 4 3,0
NANOFIT-7 = drill 1.2 square: 1 7.5,10.37; 2 5,10.37; 3 2.5,10.37; 4 0,10.37; 5 -2.5,10.37; 6 -5,10.37; 7 -7.5,10.37 | hole 1.7: -7.5,3.2; 7.5,3.2
DEBUG-CON = smd 0.7 x 4.2: 1 -2,-3.5; 2 -1,-3.5; 3 0,-3.5; 4 1,-3.5; 5 2,-3.5 | smd 0.7 x 4.2 bottom: 6 -2,-3.5; 7 -1,-3.5; 8 0,-3.5; 9 1,-3.5; 10 2,-3.5
B3S = smd 1.3 x 1.3: 1 4.1,-2.25; 2 -4.1,-2.25; 3 4.1,2.25; 4 -4.1,2.25

### Placement (x,y rotation side)
C1  8.5,22.7 180 top
C2  2.6,36.65 0 bottom
C3  3.8,23.15 0 bottom
C4  3.8,21.1 0 bottom
C5  2.85,13.4 180 bottom
C6  30.3,22.35 0 top
C7  28.15,13.15 0 top
C8  15.3,22.4 0 bottom
C9  17.45,13.15 0 bottom
C10  23.45,34.17 180 top
C11  23.45,35.3 180 top
C12  18.85,29 270 top
C13  12.75,21.25 270 bottom
C14  23.45,33.05 180 top
C15  21.5,37.35 270 top
C16  15.15,32.3 0 top
C17  15.15,33.45 0 top
C18  15.15,37.65 0 top
C19  23.5,29.35 90 top
C20  30.25,6.3 270 bottom
C21  19.95,29.35 90 top
C22  27.25,50.2 0 bottom
C23  28.7,41.8 270 bottom
C24  29.75,41.8 270 bottom
IC1  3.95,30 180 bottom
IC2  25.45,46.6 180 top
IC3  2.85,17.25 180 bottom
IC4  27.7,17.7 90 top
IC5  17.9,17.7 90 bottom
IC6  19.25,33.05 0 bottom
L1  10.7,21.35 90 bottom
Q1  15.05,35.55 90 top
Q2  21.75,28.7 180 top
R1  34.55,17.5 0 bottom
R2  34.55,15.5 0 bottom
R3  27.25,20.3 180 top
R4  30.3,20.3 180 top
R5  20.65,14.65 180 top
R6  17.2,17.85 270 top
R7  25.45,14.65 180 bottom
R8  24.1,17.7 270 top
R9  29.45,18.8 180 bottom
R10  28.15,15.2 180 top
R11  9.85,16.75 180 bottom
R12  9.85,18.8 180 bottom
R13  18.35,20.3 180 bottom
R14  15.3,20.3 180 bottom
R15  21.6,17.7 270 bottom
R16  17.45,15.2 180 bottom
R17  13,13.95 180 bottom
R18  28.2,6.3 90 bottom
R19  32.3,6.3 270 bottom
T1  20.65,17.7 0 top
T2  19.8,22.6 270 top
T3  25.45,17.7 0 bottom
T4  25.9,22.6 270 bottom
X1  6.25,52 180 top
X2  34.45,32.8 90 top
X3  15.8,47.6 180 top
X4  37,10 90 top
X5  37,18.5 270 top
X6  7.95,13.9 180 top
X7  16.6,0 0 top
X8  32.6,52 0 bottom
X9  30.05,5.8 270 top
X11  2.85,9.1 90 top

### Tracks (layer width: path | path; a pad name or v marks a point on that pad's centre or on a via)
+3V3  (via drill 0.3)
  Top 0.2: IC2.11 v22.52,44.6 22.2,44.6 21.1,43.5 13.02,43.5 12.5,43.5 11.8,44.2 X3.9 | v29.2,50.39 28.59,50.39 28.38,50.17 IC2.1
  Top 0.4: X3.9 3.2,45.6 0.71,43.11 0.71,15.99 v1.9,14.8
  Bottom 0.2: v22.52,44.6 22.52,48.12 23.6,49.2 27.9,49.2 | v29.2,50.39 29.2,49.4 29,49.2 27.9,49.2 | C22.1 27.9,49.2
  Bottom 0.4: C5.1 v1.9,14.8 IC3.5
+5V  (via drill 0.3, 0.35)
  Top 0.2: C14.1 24.9,33.05 25.15,32.8 v25.9,32.8 | v27.55,33.3 31.1,33.3 31.6,32.8 X2.7 | v29.75,43.5 29.57,43.68 IC2.20 | C15.1 21.5,38.4 v22,38.9
  Top 0.4: IC4.3 28.15,18.65 27.7,18.2 v27.7,16.3 | v29.75,43.5 34.15,43.5 v34.6,43.95 | v12.35,27.8 12.35,31.75 v12.9,32.3 C16.1 14.5,31.7 14.75,31.45 16.55,31.45 17.15,32.05 20.4,35.3 20.4,37.6 20.8,38 C15.1 | X7.3 19.1,6.7 17.7,5.3 v13.75,5.3 | v33.7,21.5 33.7,23.19 29.54,27.35 v28.55,27.35 | v7.17,21.6 8.05,20.73 v9.68,20.73
  Bottom 0.2: IC6.44 25.4,32.3 v25.9,32.8 26.4,33.3 v27.55,33.3 | IC6.36 v22,38.9 22,39.83 24.07,41.9 26.71,41.9 28.31,43.5 v29.75,43.5 C24.1 C23.1 | IC6.17 v12.9,32.3
  Bottom 0.4: C20.1 R18.2 28.2,8.8 | v27.7,16.3 27.55,16.15 27.55,8.8 | IC5.3 14.15,18.65 12.25,16.75 R11.2 R12.2 L1.1 9.9,20.5 v9.68,20.73 9.5,20.9 9.5,24.95 v12.35,27.8 | 27.55,8.8 19.55,8.8 19.1,9.25 X7.3 | 27.55,8.8 28.2,8.8 | 28.2,8.8 30.8,8.8 33.7,11.7 R2.2 R1.2 v33.7,21.5 X5.1 | C4.1 4.75,20.2 4.35,19.8 3.8,19.8 | C3.1 4.8,23.15 6.39,23.15 7.17,22.37 v7.17,21.6 | v34.6,43.95 X8.1 | 3.8,19.8 2.15,19.8 1.9,19.55 IC3.1 | v27.55,33.3 28.15,33.3 28.55,32.9 v28.55,27.35 | 5,7.83 5,16.4 3.8,17.6 IC3.3 3.8,19.8 | v13.75,5.3 5.9,5.3 5,6.2 5,7.83 | 5,7.83 X11.1
  Bottom 0.8: C3.1 4.75,24.2 3.95,25 IC1.4 | C4.1 4.8,21.15 4.8,23.15
  Bottom 1: IC1.2 IC1.4
  pour Top (isolate 0.305, rank 3): 0,52 40,52 40,0 0,0
+12V  (via drill 0.4, 0.6)
  Top 0.4: T2.3 T2.2 | C1.+ 12.8,21.2 14.5,19.5 14.5,16.3 15.15,15.65 16.85,15.65 17.2,16 R6.2
  Top 0.6: T2.2 18,23.23
  Top 1.25: C1.+ 12.8,26 13,26 | T2.2 T2.1 17.2,26 18,26
  Top 1.8: X1.2 7.5,37.6 7.5,36 7.5,27.5 9,26 13,26 18,26 26,26 26.7,25.3 v26.7,24.5
  Bottom 0.4: R9.2 30.4,21.7 30.14,21.96 T4.3
  Bottom 0.6: 29.7,21.96 29.7,23.23 | 29.7,23.23 T4.2 27.07,23.23 v26.7,23.6 | 29.7,23.23 29.7,24.5 T4.1 v26.7,24.5 | v25.8,21.8 v25.8,22.7 v25.8,23.6 v25.8,24.5 v26.7,24.5 | v26.7,24.5 v26.7,23.6 | v26.7,23.6 v26.7,22.7 v26.7,21.8 26.86,21.96 T4.3
  Bottom 0.8: IC1.3 6.26,36.65 | C2.1 6.26,36.65 | X1.2 7.5,40 6.26,38.76 6.26,36.65
  other vias: 9.1,36.8 10.3,36.8 9.1,35.6 10.3,35.6 9.1,34.4 10.3,34.4 9.1,33.2 10.3,33.2 10.3,32 9.1,32 12.3,25.2 11.1,25.2 12.3,26.4 19.1,22 19.1,23.2 19.1,24.4
  pour Bottom (isolate 0.305, no thermals): 25.35,21.4 29.9,21.4 29.9,25 25.35,25
  pour Top (isolate 0.305, rank 2, no thermals): 6.4,42.8 12.4,42.8 12.4,29.2 28.8,29.2 28.8,21.4 6.4,21.4
AGND  (via drill 0.3)
  Top 0.2: v18.85,27.45 C12.2
  Top 0.4: C6.2 R4.1 31.15,18.3 30.55,17.7 30.2,17.7 | IC4.2 30.2,17.7 | C7.2 29.75,13.15 30.2,13.6 v30.2,16.8 30.2,17.7 | v12.75,16 v12.75,18.9 | v14.45,27.45 v18.85,27.45
  Bottom 0.2: IC6.5 20,27.65 19.8,27.45 v18.85,27.45
  Bottom 0.4: v30.2,16.8 28.19,16.8 27.29,17.7 IC5.2 14.75,17.7 14.4,17.35 14.4,16 | v14.45,27.45 C8.2 R14.1 C13.2 v12.75,18.9 | C9.2 14.4,13.15 R17.2 | R17.2 14.05,13.95 | R17.2 14.4,16 | v12.75,16 14.4,16
  pour Bottom (isolate 0.305, rank 2): 9.6,25.6 13.2,29.2 14,29.2 22,29.2 22,26 30,26 31.2,24.8 31.2,16.8 28.8,14.4 24,14.4 24,17.2 16.4,17.2 16.4,12.8 9.6,12.8
  pour Top (rank 2): 6.4,20.8 32,20.8 32,12 6.4,12
CON0_HEATER_0
  Top 0.4: IC4.5 25.65,16.75 25.18,16.28 R8.2
  Top 1: 24.1,15.7 R8.2
  Top 1.8: X7.1 24.1,15.7
CON0_HEATER_0_CUR  (via drill 0.3)
  Top 0.2: v28.35,12.05 27.75,12.05 27.3,12.5 C7.1
  Top 0.4: C7.1 R10.2
  Bottom 0.2: IC6.9 18,27.15 18.55,26.6 30,26.6 30.07,26.6 31.6,25.07 31.6,16.6 28.35,13.35 v28.35,12.05
CON0_HEATER_0_IN
  Top 0.4: R8.1 25.18,19.12 25.65,18.65 IC4.4 R3.2
  Top 0.5: R8.1 24.1,20.7 | 24.1,20.7 T2.5 | 24.1,20.7 24.1,21.96 | 24.1,21.96 T2.6 | 24.1,21.96 24.1,23.23 | 24.1,23.23 T2.7 | T2.8 23.8,24.5 24.1,24.2 24.1,23.23
  pour Top (no thermals): 24.9,24.8 24.9,19.6 23.3,19.6 23.3,20.5 21.3,20.5 21.3,24.8
CON0_HEATER_0_VOL  (via drill 0.3)
  Top 0.2: C6.1 v29.45,26
  Top 0.4: C6.1 R4.2 R3.1
  Bottom 0.2: v29.45,26 29.25,26.2 18.38,26.2 17.5,27.08 IC6.10
CON0_HEATER_1
  Bottom 0.4: R15.2 20.52,16.28 20.05,16.75 IC5.5
  Bottom 1: 21.6,15.6 R15.2
  Bottom 1.8: X7.2 21.6,15.6
CON0_HEATER_1_CUR  (via drill 0.3, 0.35)
  Top 0.2: v15.3,16.75 v15.3,21.4
  Bottom 0.2: 18.3,14.15 16.05,14.15 15.65,14.55 15.65,16.4 v15.3,16.75 | IC6.12 16.5,27.07 15.3,25.87 v15.3,21.4
  Bottom 0.6: C9.1 18.3,14.15 R16.2
CON0_HEATER_1_IN
  Bottom 0.4: R15.1 20.52,19.12 20.05,18.65 IC5.4 R13.2
  Bottom 0.5: T4.8 21.91,24.5 21.6,24.2 21.6,23.23 | R15.1 21.6,20.7 | 21.6,20.7 T4.5 | 21.6,20.7 21.6,21.96 | 21.6,21.96 T4.6 | 21.6,21.96 21.6,23.23 | 21.6,23.23 T4.7
  pour Bottom (no thermals): 20.8,24.85 20.8,19.6 22.4,19.6 22.4,20.4 24.45,20.4 24.45,24.85
CON0_HEATER_1_VOL
  Bottom 0.2: C8.1 16.15,26.15 17,27 IC6.11
  Bottom 0.4: C8.1 R14.2 R13.1
CON0_SCL  (via drill 0.3)
  Top 0.2: X7.4 13.07,13.9 X6.1 8.35,13.9 7.95,14.3 7.95,15.45 v7.3,16.1
  Bottom 0.2: X6.1 9,14.12 R11.1 | IC6.14 13.62,30.8 8.6,25.78 8.6,20.3 7.3,19 v7.3,16.1
CON0_SDA
  Top 0.2: X7.5 14.1,11.55 13.75,11.9 7,11.9 6.68,12.22 X6.2
  Bottom 0.2: IC6.13 13.68,30.3 9,25.62 R12.1 8.25,18.8 7.95,18.5 7.95,14.25 7.6,13.9 X6.2
EXT_SCL  (via drill 0.3)
  Top 0.2: X4.2 38.57,11.27 38.99,11.69 38.99,15 38.49,15.5 X5.4 35.6,16.9 35.6,41.43 34.63,42.4 19.6,42.4 v16.8,39.6
  Bottom 0.2: R2.1 X5.4 | IC6.26 17,39.4 v16.8,39.6
EXT_SDA  (via drill 0.35)
  Top 0.2: X4.1 38.78,8.73 39.39,9.34 39.39,16.61 38.5,17.5 X5.3 36,18.5 36,41.6 34.8,42.8 18.8,42.8 v16.8,40.8
  Bottom 0.2: R1.1 X5.3 | IC6.25 16.5,38.7 16,39.2 16,40 v16.8,40.8
GND  (via drill 0.3, 0.35)
  Top 0.2: C16.2 C17.2 | C19.2 24.3,30 24.8,29.5 v24.8,28.2 29.4,28.2 32.4,25.2 v34.4,25.2 | IC2.10 v22.52,50.65 | 21.95,35.3 C11.2 C10.2 C14.2 v21.95,33.05 21.95,35.3 | 21.95,35.3 v21.5,35.3 C15.2
  Top 0.4: X9.3 X9.1 26.5,1.7 26,2.2 v26,7.2 v26,10 | T1.2 R5.1 21.6,12.6 21,12 19.85,12 v19.8,12.05 | C19.2 C21.2 | v15.2,39.2 15.8,38.6 C18.2 16.45,37.65 16.75,37.35 v16.75,33.45 | 15.95,33.6 C17.2 16.7,33.45 v16.75,33.45 | C16.2 16.35,32.3 16.75,32.7 v16.75,33.45
  Top 1: X1.1 4.2,40.83 C1.- 4.2,10.37 | X7.7 4.2,10.37 | 4.2,10.37 X11.2
  Bottom 0.2: IC6.42 22.2,33.3 v21.95,33.05 21.95,30.45 24.2,28.2 v24.8,28.2 | v21.5,35.3 IC6.35 | v21.5,35.3 20.1,35.3 18.4,33.6 16.9,33.6 v16.75,33.45 16.1,32.8 IC6.18 | C22.2 26.6,51.2 26.4,51.2 | v21.5,35.3 22.95,36.75 22.95,38.95 25.15,41.15 C23.2 C24.2
  Bottom 0.4: 11.6,12.05 R17.1 | v19.8,12.05 11.6,12.05 | X7.6 11.6,12.05 | R7.1 24.5,13.3 25.6,12.2 25.6,10.4 v26,10 | 0.95,23.15 0.95,27.85 | 2.85,17.3 1.45,17.3 0.95,17.8 0.95,21.1 | C3.2 0.95,23.15 | 2.85,17.3 2.85,15.35 3.8,14.4 C5.2 3.8,12.2 2.85,11.25 X11.2 | C4.2 0.95,21.1 | X8.2 33.6,50.8 33.2,51.2 32.6,51.2 | 32.6,51.2 26.4,51.2 23.07,51.2 v22.52,50.65 22.52,49.73 22,49.2 13.4,49.2 X3.10 | X8.3 32.6,51.2 | 0.95,21.1 0.95,23.15 | X5.2 37.9,19.5 38.8,20.4 38.8,22.4 38,23.2 36.8,23.2 35.85,24.15 35.85,25.2 | X2.8 35.85,31.4 35.85,25.2 | v34.4,25.2 35.85,25.2 | 2.85,17.3 IC3.2
  Bottom 0.6: R7.1 T3.2 | C2.2
  Bottom 0.8: v26,7.2 11.6,7.2 | 11.6,7.2 10,7.2 9.1,8.1 X7.7 | X7.6 11.6,7.2 | X3.10 10.8,47.6 10.4,47.2 10.4,43.6 | v15.2,39.2 15.2,42.4 14,43.6 10.4,43.6 | 10.4,43.6 5.6,43.6 5,43 X1.1 2.83,41.63 1.65,40.45 C2.2 | IC1.1 C2.2
  pour Bottom (isolate 0.305, rank 3): 0,52 40,52 40,36.8 40,0 0,0
  pour Top (no thermals): 0,42.8 6,42.8 6,11.6 12.8,11.6 12.8,0 0,0
HEATER0_AD_OUT0
  Top 0.4: R10.1 IC4.1
HEATER0_AD_OUT1
  Bottom 0.4: R16.1 IC5.1
HEATER0_G0
  Top 0.4: T2.4 R6.1 T1.3
HEATER0_G1
  Bottom 0.4: T4.4 R9.1 T3.3
HEATER_CTRL_0  (via drill 0.3)
  Top 0.2: R5.2 11.95,14.65 9.75,16.85 v6.45,16.85
  Top 0.4: R5.2 T1.1
  Bottom 0.2: IC6.15 13.55,31.3 8.53,26.27 8.2,25.95 8.2,20.47 6.45,18.72 v6.45,16.85
HEATER_CTRL_1  (via drill 0.3)
  Top 0.2: v26.75,11.3 26.75,9.2 26.75,8.95 v26.75,6.1
  Bottom 0.2: v26.75,11.3 26.4,11.65 R7.2 | IC6.16 13.48,31.8 7.8,26.12 7.8,20.63 5.5,18.33 5.5,8.5 7.9,6.1 v26.75,6.1
  Bottom 0.6: R7.2 T3.1
IO_0  (via drill 0.3)
  Top 0.2: X2.1 31.83,26.8 30.03,28.6 26.3,28.6 24.2,30.7 20.3,30.7 19.9,31.1 19.67,31.33 17.93,31.33 17.5,30.9 v17.5,30.4
  Bottom 0.2: IC6.8 18.5,29.89 17.99,30.4 v17.5,30.4
IO_1  (via drill 0.3)
  Top 0.2: v18.58,32.33 18.79,32.13 20,32.13 20.63,31.5 24.53,31.5 26.63,29.4 31.85,29.4 X2.3
  Bottom 0.2: v18.58,32.33 20.5,30.41 IC6.4
IO_2  (via drill 0.3)
  Top 0.2: v21,33.45 21,33.06 21.76,32.3 24.86,32.3 26.96,30.2 31.85,30.2 X2.5
  Bottom 0.2: v21,33.45 21.35,33.8 IC6.41
IO_3
  Bottom 0.2: X2.9 31.95,35.3 IC6.38
IO_3V3[0]
  Top 0.2: X3.4 18.7,48.5 20.17,48.5 21.47,47.2 25.8,47.2 26.43,47.83 IC2.4
IO_3V3[0]_HI  (via drill 0.3)
  Top 0.2: IC2.17 v26.43,44.9
  Bottom 0.2: IC6.31 19.5,39.6 23.4,43.5 25.02,43.5 v26.43,44.9
IO_3V3[1]
  Top 0.2: X3.2 20.51,47.6 21.31,46.8 27,46.8 27.73,47.52 IC2.2
IO_3V3[1]_HI  (via drill 0.3)
  Top 0.2: IC2.19 v27.73,44.9
  Bottom 0.2: v27.73,44.9 25.93,43.1 23.57,43.1 20,39.53 IC6.32
IO_3V3[2]
  Top 0.2: X3.3 18.7,44.7 20.17,44.7 21.47,46 25.4,46 25.77,45.62 IC2.16
IO_3V3[2]_HI  (via drill 0.3)
  Top 0.2: IC2.5 v25.77,48.1
  Bottom 0.2: v25.77,48.1 28.4,45.48 28.4,44.72 26.38,42.7 23.73,42.7 20.5,39.47 IC6.33
IO_3V3[3]
  Top 0.2: X3.1 20.5,45.6 21.3,46.4 26.6,46.4 27.07,45.92 IC2.18
IO_3V3[3]_HI  (via drill 0.3)
  Top 0.2: v27.07,48.1 IC2.3
  Bottom 0.2: IC6.34 21,39.4 23.9,42.3 26.54,42.3 28.8,44.56 28.8,46.38 v27.07,48.1
IO_3V3[4]
  Top 0.2: X3.6 17.1,48.9 20.34,48.9 21.64,47.6 24.6,47.6 25.12,48.12 IC2.6
IO_3V3[4]_HI  (via drill 0.3)
  Top 0.2: IC2.15 v25.12,44.9
  Bottom 0.2: v25.12,44.9 24.12,43.9 23.23,43.9 19.57,40.25 18,40.25 17.5,39.75 IC6.27
IO_4  (via drill 0.3)
  Top 0.2: X2.11 31.83,36.8 27.93,40.71 22.31,40.71 19.9,38.3 19.9,36.1 v19.2,35.4
  Bottom 0.2: v19.2,35.4 18.1,34.3 IC6.21
IO_5  (via drill 0.3)
  Top 0.2: v18.87,39.13 21.34,41.6 29.65,41.6 X2.13
  Bottom 0.2: v18.87,39.13 19,39 IC6.30
IO_6  (via drill 0.3)
  Top 0.2: 20.38,31.18 20.47,31.1 24.37,31.1 26.47,29 30.2,29 31.4,27.8 33.45,27.8 X2.2 | 20.38,31.18 20.24,31.33 | 20.38,31.18 19.84,31.73 17.76,31.73 v16.5,30.47
  Bottom 0.2: IC6.7 19,30 17.9,31.1 17.13,31.1 v16.5,30.47
IO_7  (via drill 0.3)
  Top 0.2: 21.2,31.9 24.7,31.9 26.8,29.8 33.45,29.8 X2.4 | 21.2,31.9 21.11,31.9 | 21.2,31.9 20.8,31.9 20.17,32.53 19.8,32.53 19.45,32.88 v19.45,32.91
  Bottom 0.2: IC6.3 20.95,28.85 20.95,30.82 19.45,32.32 v19.45,32.91
IO_8  (via drill 0.3)
  Top 0.2: X2.6 33.45,31.8 27.1,31.8 26.85,32.05 26.85,34.59 v26.95,34.7
  Bottom 0.2: IC6.39 26.85,34.8 v26.95,34.7
IO_9
  Bottom 0.2: X2.10 33.45,35.8 IC6.37
IO_10  (via drill 0.3)
  Top 0.2: X2.12 33.45,37.8 31.8,37.8 28.49,41.11 22.14,41.11 19.5,38.47 19.5,36.95 v18.45,35.9
  Bottom 0.2: v18.45,35.9 17.35,34.8 IC6.22
IO_11  (via drill 0.3)
  Top 0.2: v18.1,39.5 20.6,42 31.25,42 X2.14
  Bottom 0.2: v18.1,39.5 18.1,38.7 18.5,38.3 IC6.29
RESET_SW_IN  (via drill 0.3)
  Top 0.4: X9.2 X9.4 v32.3,8.5
  Bottom 0.4: R19.1 v32.3,8.5
RESETN  (via drill 0.3)
  Top 0.2: IC2.7 24.48,50.67 24.79,50.99 30.35,50.99 30.6,50.74 X8.10 v30.6,45.35 | v29.05,34 v29.05,37.4 | v33.65,10.05 33.65,10.95 32,12.6 v32,13.4
  Bottom 0.2: IC6.40 26.15,34.3 26.45,34 v29.05,34 29.05,28.18 32,25.23 v32,13.4 | v33.65,10.05 33.65,5.85 33.25,5.45 R19.2 | v29.05,37.4 29.05,38.18 30.6,39.73 v30.6,45.35
  Bottom 0.4: R19.2 C20.2 R18.1
RESETN_3V3
  Top 0.2: X3.5 17.1,44.3 20.34,44.3 21.64,45.6 24.2,45.6 24.48,45.33 IC2.14
SWCLK  (via drill 0.3)
  Top 0.2: IC2.13 v23.82,44.9 | v27.55,32.45 v29.75,32.45 | v29.85,44.4 v31.6,44.4 X8.9 | v29.75,36.55 v29.75,34.7
  Bottom 0.2: v23.82,44.9 23.82,47.42 25.2,48.8 28.4,48.8 29.85,47.35 v29.85,44.4 | IC6.45 26.6,31.8 27.25,32.45 v27.55,32.45 | v29.75,34.7 v29.75,32.45 | v29.75,36.55 29.75,38.32 31.6,40.17 v31.6,44.4
SWCLK_3V3
  Top 0.2: X3.8 15.5,49.3 20.5,49.3 21.8,48 23.4,48 23.82,48.42 IC2.8
SWDIO  (via drill 0.3)
  Top 0.2: IC2.9 23.18,50.98 23.59,51.39 34.16,51.39 34.6,50.95 X8.6 34.6,45.4 33.6,44.4 v32.41,44.4 | v30.7,34 v30.7,36.8 | v30.7,31.05 v27.45,31.05
  Bottom 0.2: v27.45,31.05 27.35,31.05 27.1,31.3 IC6.46 | v30.7,34 v30.7,31.05 | v30.7,36.8 30.7,38.7 32.41,40.41 v32.41,44.4
SWDIO_3V3
  Top 0.2: X3.7 15.5,43.9 20.5,43.9 21.8,45.2 22.9,45.2 23.18,44.92 IC2.12
VDDANA  (via drill 0.3)
  Top 0.2: v19.13,30.73 18.85,30.45 C12.1
  Top 0.4: v13.4,27.45 13.4,28.95 14.1,29.65 C12.1
  Bottom 0.2: 19.55,28.85 IC6.6 19.5,30.35 v19.13,30.73
  Bottom 0.4: v13.4,27.45 13.4,23.8 12.75,23.15 C13.1 L1.2
VDDCORE  (via drill 0.3)
  Top 0.2: v25.35,33.65 24.82,34.17 C10.1 C11.1
  Bottom 0.2: IC6.43 24.5,32.8 v25.35,33.65
XIN  (via drill 0.3)
  Top 0.2: v13.25,35.05 13.53,34.77 Q1.1 14.5,34.77 C17.1
  Bottom 0.2: IC6.23 13.5,35.3 v13.25,35.05
XIN32  (via drill 0.3)
  Top 0.2: v22.25,27.45 22.55,27.75 Q2.1 22.3,28.7
  Top 0.4: Q2.1 C19.1
  Bottom 0.2: v22.25,27.45 22,27.7 IC6.1
XOUT  (via drill 0.3)
  Top 0.2: v13.25,36.05 13.53,36.33 Q1.2 14.5,36.33 C18.1
  Bottom 0.2: IC6.24 13.5,35.8 v13.25,36.05
XOUT32  (via drill 0.3)
  Top 0.2: v21.25,27.45 20.95,27.75 Q2.2 21.2,28.7
  Top 0.4: C21.1 Q2.2
  Bottom 0.2: v21.25,27.45 21.5,27.7 IC6.2

### Text on the board
tPlace: GND | +5V
tNames: SDA | SCL | SCL | SDA